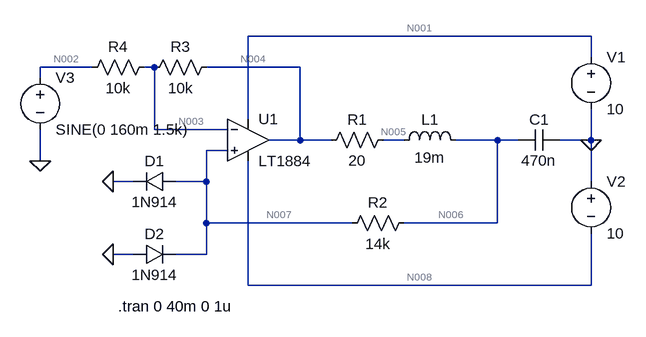
[diagram p0: schematic DuffingHolmesOscilator.asc]
DuffingHolmesOscilator.asc, the LTspice schematic file:
Version 4
SHEET 1 880 680
WIRE 544 -32 16 -32
WIRE 544 0 544 -32
WIRE -224 16 -304 16
WIRE -128 16 -144 16
WIRE 96 16 -48 16
WIRE -304 32 -304 16
WIRE 16 96 16 -32
WIRE -128 112 -128 16
WIRE -16 112 -128 112
WIRE 96 128 96 16
WIRE 96 128 48 128
WIRE 144 128 96 128
WIRE 256 128 224 128
WIRE 400 128 336 128
WIRE 432 128 400 128
WIRE 544 128 544 80
WIRE 544 128 496 128
WIRE 560 128 544 128
WIRE -16 144 -48 144
WIRE -304 160 -304 112
WIRE -160 192 -192 192
WIRE -48 192 -48 144
WIRE -48 192 -96 192
WIRE 544 192 544 128
WIRE -48 256 -48 192
WIRE 176 256 -48 256
WIRE 400 256 400 128
WIRE 400 256 256 256
WIRE -160 304 -192 304
WIRE -48 304 -48 256
WIRE -48 304 -96 304
WIRE 16 352 16 160
WIRE 544 352 544 272
WIRE 544 352 16 352
FLAG -192 192 0
FLAG -192 304 0
FLAG -304 160 0
FLAG 544 128 0
SYMBOL ind 240 144 R270
WINDOW 0 32 56 VTop 2
WINDOW 3 5 56 VBottom 2
SYMATTR InstName L1
SYMATTR Value 19m
SYMBOL cap 496 112 R90
WINDOW 0 0 32 VBottom 2
WINDOW 3 32 32 VTop 2
SYMATTR InstName C1
SYMATTR Value 470n
SYMBOL res 128 144 R270
WINDOW 0 32 56 VTop 2
WINDOW 3 0 56 VBottom 2
SYMATTR InstName R1
SYMATTR Value 20
SYMBOL voltage 544 -16 R0
WINDOW 123 0 0 Left 2
WINDOW 39 0 0 Left 2
SYMATTR InstName V1
SYMATTR Value 10
SYMBOL voltage 544 176 R0
WINDOW 123 0 0 Left 2
WINDOW 39 0 0 Left 2
SYMATTR InstName V2
SYMATTR Value 10
SYMBOL res 160 272 R270
WINDOW 0 32 56 VTop 2
WINDOW 3 0 56 VBottom 2
SYMATTR InstName R2
SYMATTR Value 14k
SYMBOL res -144 32 R270
WINDOW 0 32 56 VTop 2
WINDOW 3 0 56 VBottom 2
SYMATTR InstName R3
SYMATTR Value 10k
SYMBOL res -240 32 R270
WINDOW 0 32 56 VTop 2
WINDOW 3 0 56 VBottom 2
SYMATTR InstName R4
SYMATTR Value 10k
SYMBOL diode -96 176 R90
WINDOW 0 0 32 VBottom 2
WINDOW 3 32 32 VTop 2
SYMATTR InstName D1
SYMATTR Value 1N914
SYMBOL diode -160 288 M90
WINDOW 0 0 32 VBottom 2
WINDOW 3 32 32 VTop 2
SYMATTR InstName D2
SYMATTR Value 1N914
SYMBOL Opamps\\LT1884 16 64 R0
SYMATTR InstName U1
SYMBOL voltage -304 16 R0
WINDOW 123 0 0 Left 2
WINDOW 39 0 0 Left 2
SYMATTR InstName V3
SYMATTR Value SINE(0 160m 1.5k)
TEXT -184 384 Left 2 !.tran 0 40m 0 1u

The netlist it stands for:
* DuffingHolmesOscilator.asc
L1 N005 N006 19m
C1 0 N006 470n
R1 N004 N005 20
V1 N001 0 10
V2 0 N008 10
R2 N007 N006 14k
R3 N003 N004 10k
R4 N002 N003 10k
D1 N007 0 1N914
D2 0 N007 1N914
XU1 N007 N003 N001 N008 N004 LT1884  ; pins In+ In- V+ V- OUT
V3 N002 0 SINE(0 160m 1.5k)
.model D D
.lib standard.dio
.tran 0 40m 0 1u
.backanno
.end

* Results of the author's LTspice run, read from the files saved beside the schematic
* Operating Point, zero values left out:
*   V(n005) = 851.1 mV
*   V(n006) = 851.1 mV
*   V(n004) = 851.7 mV
*   V(n001) = 10 V
*   V(n008) = -10 V
*   V(n007) = 425.9 mV
*   V(n003) = 425.8 mV
*   I(D2) = -2.52 nA
*   I(D1) = 30.37 µA
*   I(L1) = 30.37 µA
*   I(R4) = -42.58 µA
*   I(R3) = -42.59 µA
*   I(R2) = -30.37 µA
*   I(R1) = 30.37 µA
*   I(V3) = 42.58 µA
*   I(V2) = -577.2 µA
*   I(V1) = -650.1 µA
*   Ix(u1:1) = 111.9 pA
*   Ix(u1:2) = 111.9 pA
*   Ix(u1:3) = 650.1 µA
*   Ix(u1:4) = -577.2 µA
*   Ix(u1:5) = -72.96 µA
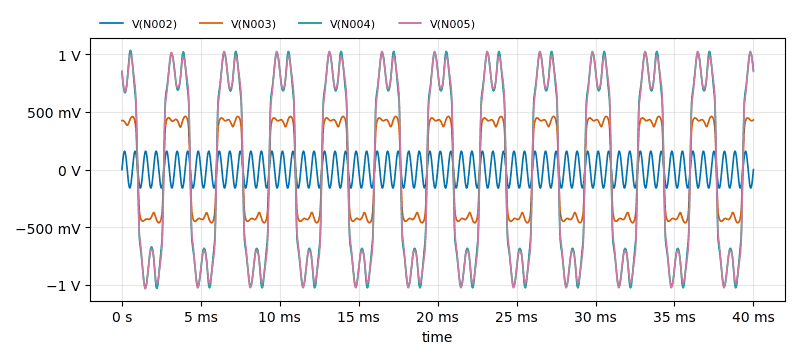
[diagram p1: Transient Analysis of DuffingHolmesOscilator.asc, plotted from the saved traces]
* Transient Analysis, 1 run:
*   V(N002): min -160 mV, max 160 mV, average 5.025 µV, rms 113.1 mV, last 0 V
*   V(N003): min -461.6 mV, max 461.7 mV, average 195 µV, rms 407.2 mV, last 430.7 mV
*   V(N004): min -1.031 V, max 1.035 V, average 386.1 µV, rms 804.7 mV, last 861.3 mV
*   V(N005): min -1.034 V, max 1.026 V, average 375.2 µV, rms 803.4 mV, last 852.2 mV